# EAGLE design matrix-only (EAGLE 6.5.0)
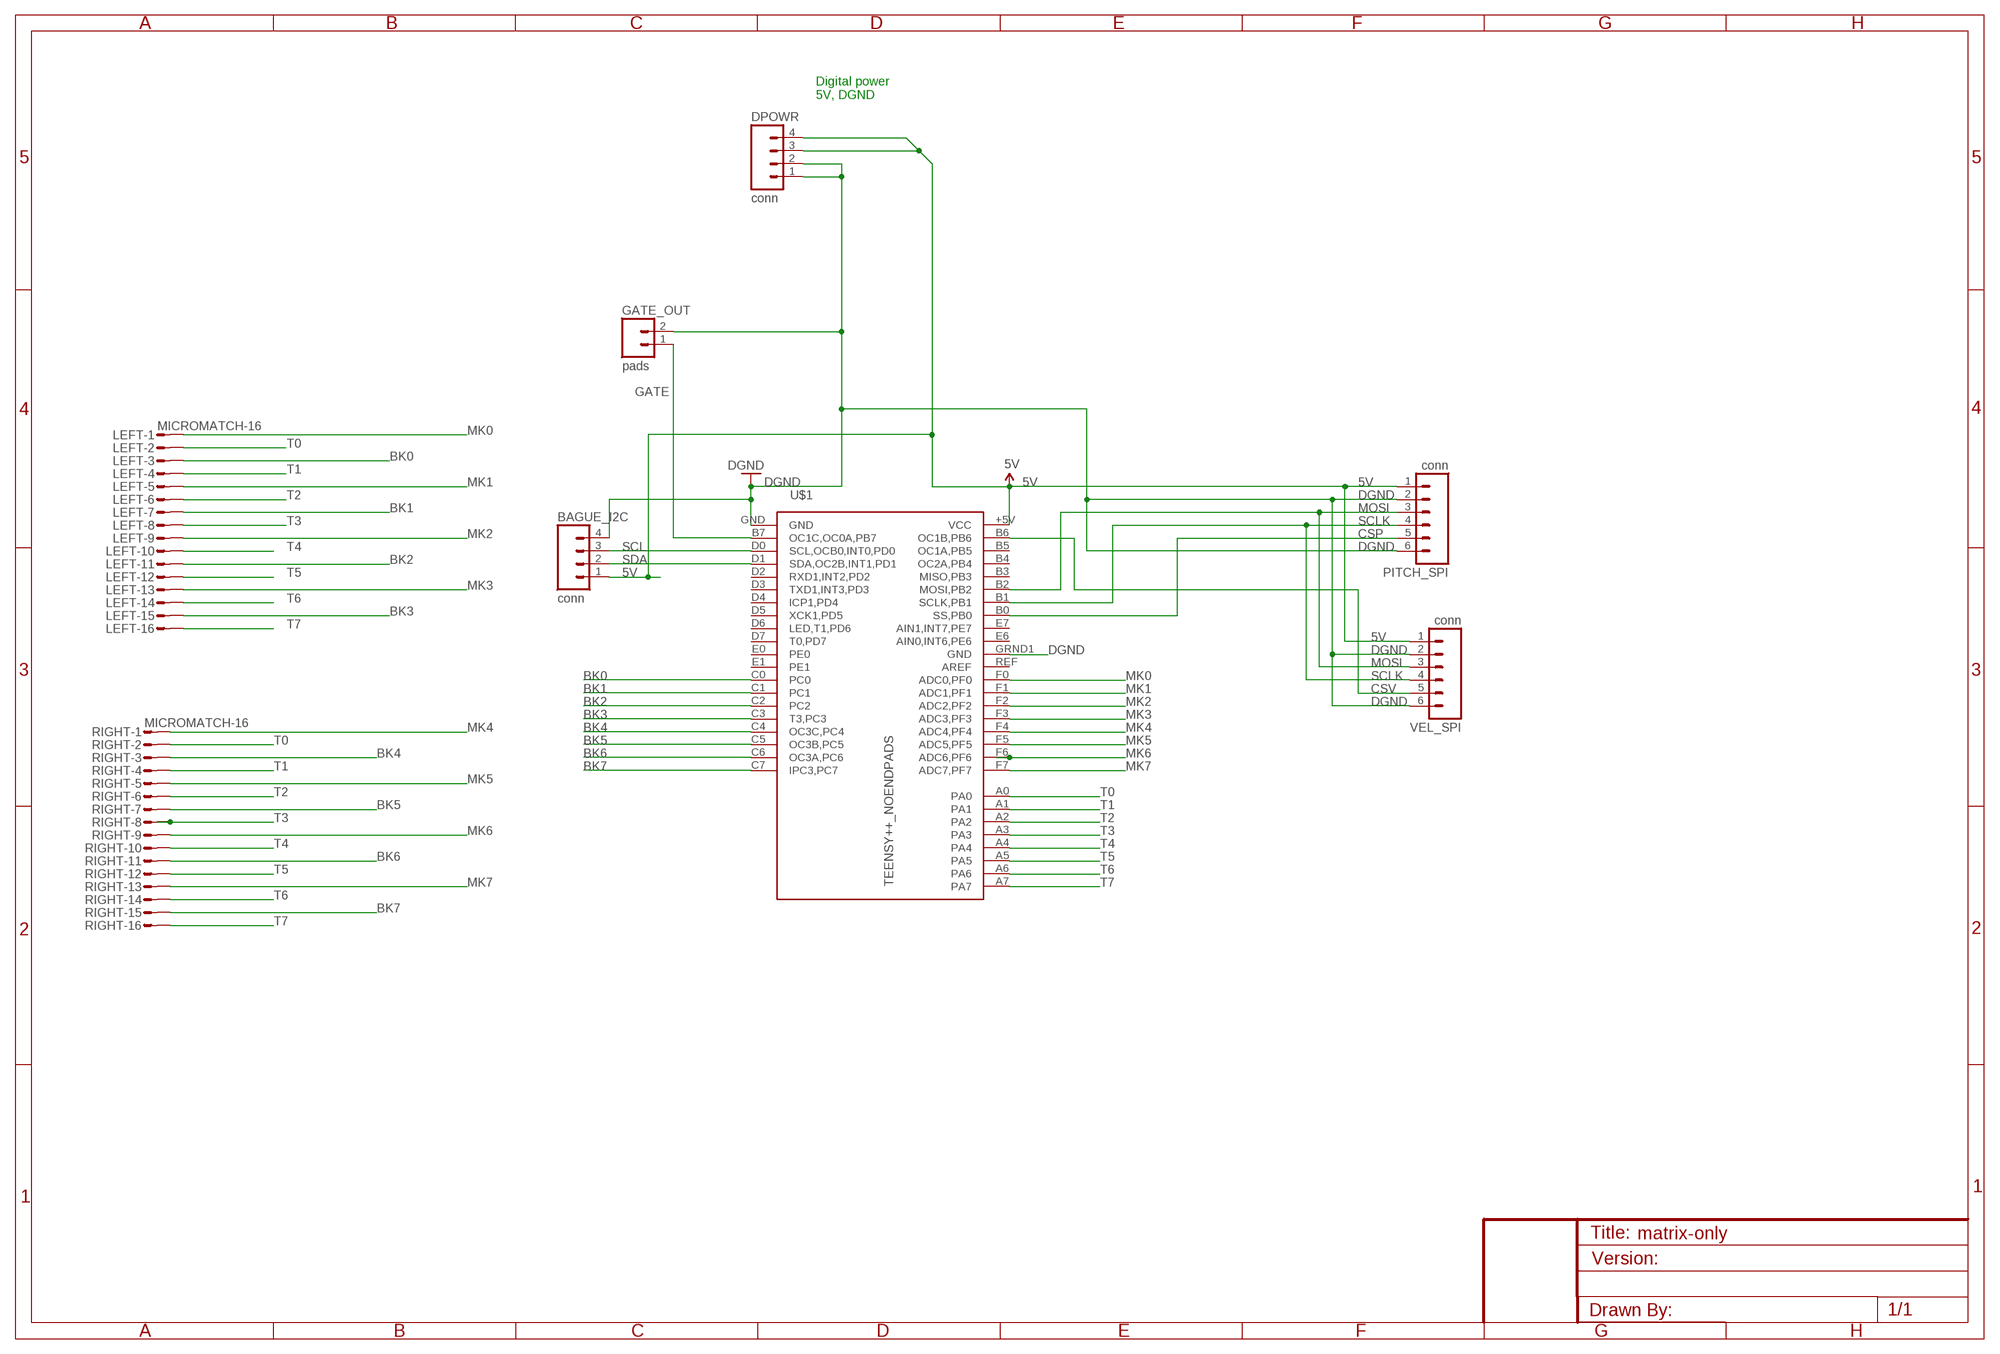
[diagram p0: schematic, sheet 1]

## Parts
BAGUE_I2C  conn  M04LOCK  [1X04_LOCK]
DPOWR  conn  M04PTH  [1X04]
GATE_OUT  pads  M02PTH3  [1X02_LONGPADS]
LEFT  MICROMATCH-16  [MICROMATCH-16]
PITCH_SPI  conn  M06SIP  [1X06]
RIGHT  MICROMATCH-16  [MICROMATCH-16]
U$1  TEENSY++_NOENDPADS  [TEENSY++]
VEL_SPI  conn  M06SIP  [1X06]

## Nets
5V: BAGUE_I2C.1 DPOWR.3 DPOWR.4 PITCH_SPI.1 U$1.+5V(VCC) VEL_SPI.1
BK0: LEFT.3 U$1.C0
BK1: LEFT.7 U$1.C1
BK2: LEFT.11 U$1.C2
BK3: LEFT.15 U$1.C3(T3,PC3)
BK4: RIGHT.3 U$1.C4(OC3C,PC4)
BK5: RIGHT.7 U$1.C5(OC3B,PC5)
BK6: RIGHT.11 U$1.C6(OC3A,PC6)
BK7: RIGHT.15 U$1.C7(IPC3,PC7)
CSP: PITCH_SPI.5 U$1.B0(SS,PB0)
CSV: U$1.B6(OC1B,PB6) VEL_SPI.5
DGND: BAGUE_I2C.4 DPOWR.1 DPOWR.2 GATE_OUT.2 PITCH_SPI.2 PITCH_SPI.6 U$1.GND U$1.GRND1(GND) VEL_SPI.2 VEL_SPI.6
GATE: GATE_OUT.1 U$1.B7(OC1C,OC0A,PB7)
MK0: LEFT.1 U$1.F0(ADC0,PF0)
MK1: LEFT.5 U$1.F1(ADC1,PF1)
MK2: LEFT.9 U$1.F2(ADC2,PF2)
MK3: LEFT.13 U$1.F3(ADC3,PF3)
MK4: RIGHT.1 U$1.F4(ADC4,PF4)
MK5: RIGHT.5 U$1.F5(ADC5,PF5)
MK6: RIGHT.9 U$1.F6(ADC6,PF6)
MK7: RIGHT.13 U$1.F7(ADC7,PF7)
MOSI: PITCH_SPI.3 U$1.B2(MOSI,PB2) VEL_SPI.3
SCL: BAGUE_I2C.3 U$1.D0(SCL,OCB0,INT0,PD0)
SCLK: PITCH_SPI.4 U$1.B1(SCLK,PB1) VEL_SPI.4
SDA: BAGUE_I2C.2 U$1.D1(SDA,OC2B,INT1,PD1)
T0: LEFT.2 RIGHT.2 U$1.A0
T1: LEFT.4 RIGHT.4 U$1.A1
T2: LEFT.6 RIGHT.6 U$1.A2
T3: LEFT.8 RIGHT.8 U$1.A3
T4: LEFT.10 RIGHT.10 U$1.A4
T5: LEFT.12 RIGHT.12 U$1.A5
T6: LEFT.14 RIGHT.14 U$1.A6
T7: LEFT.16 RIGHT.16 U$1.A7
Unconnected: U$1.B3(MISO,PB3) U$1.B4(OC2A,PB4) U$1.B5(OC1A,PB5) U$1.D2(RXD1,INT2,PD2) U$1.D3(TXD1,INT3,PD3) U$1.D4(ICP1,PD4) U$1.D5(XCK1,PD5) U$1.D6(LED,T1,PD6) U$1.D7(T0,PD7) U$1.E0 U$1.E1 U$1.E6(AIN0,INT6,PE6) U$1.E7(AIN1,INT7,PE7) U$1.REF(AREF)

## Notes on the sheet
- Digital power
  5V, DGND

## Library data of the parts
BAGUE_I2C DPOWR = SparkFun-Connectors:M04: Header 4 Standard 4-pin 0.1" header. Use with straight break away headers (SKU : PRT-00116), right angle break away headers (PRT-00553), swiss pins (PRT-00743), machine pins (PRT-00117), and female headers (PRT-00115). Molex polarized connector foot print use with SKU : PRT-08231 with associated crimp pins and housings. 1MM SMD Version SKU: PRT-10208
GATE_OUT = SparkFun-Connectors:M02: Standard 2-pin 0.1" header. Use with - straight break away headers ( PRT-00116) - right angle break away headers (PRT-00553) - swiss pins (PRT-00743) - machine pins (PRT-00117) - female headers (PRT-00115) Molex polarized connector foot print use with: PRT-08233 with associated crimp pins and housings. 2.54_SCREWTERM for use with PRT-10571. 3.5mm Screw Terminal footprints for PRT-08084 5mm Screw Terminal footprints for use with PRT-08433
LEFT RIGHT = con-amp-micromatch:MICROMATCH-16: MicroMaTch 16 8-215464-6 / 1-215464-6 Drawing Number C-215464 DDEController.pdf; MF: FARNELL; MPN: 8-215464-6; OC_FARNELL: 3784680; OC_NEWARK: 26H3309
PITCH_SPI VEL_SPI = SparkFun-Connectors:M06: Header 6 Standard 6-pin 0.1" header. Use with straight break away headers (SKU : PRT-00116), right angle break away headers (PRT-00553), swiss pins (PRT-00743), machine pins (PRT-00117), and female headers (PRT-00115). Molex polarized connector foot print use with SKU : PRT-08094 with associated crimp pins and housings. NOTES ON THE VARIANTS LOCK and LOCK_LONGPADS... This footprint was designed to help hold the alignment of a through-hole component (i.e. 6-pin header) while soldering it into place. You may notice that each hole has been shifted either up or down by 0.005 of an inch from it's more standard position (which is a perfectly straight line). This slight alteration caused the pins (the squares in the middle) to touch the edges of the holes. Because they are alternating, it causes a "brace" to hold the component in place. 0.005 has proven to be the perfect amount of "off-center" position when using our standard breakaway headers. Although looks a little odd when you look at the bare footprint, once you have a header in there, the alteration is very hard to notice. Also,if you push a header all the way into place, it is covered up entirely on the bottom side. This idea of altering the position of holes to aid alignment will be further integrated into the Sparkfun Library for other footprints. It can help hold any component with 3 or more connection pins.
U$1 = Teensy:TEENSY++_NOENDPADS

## Board
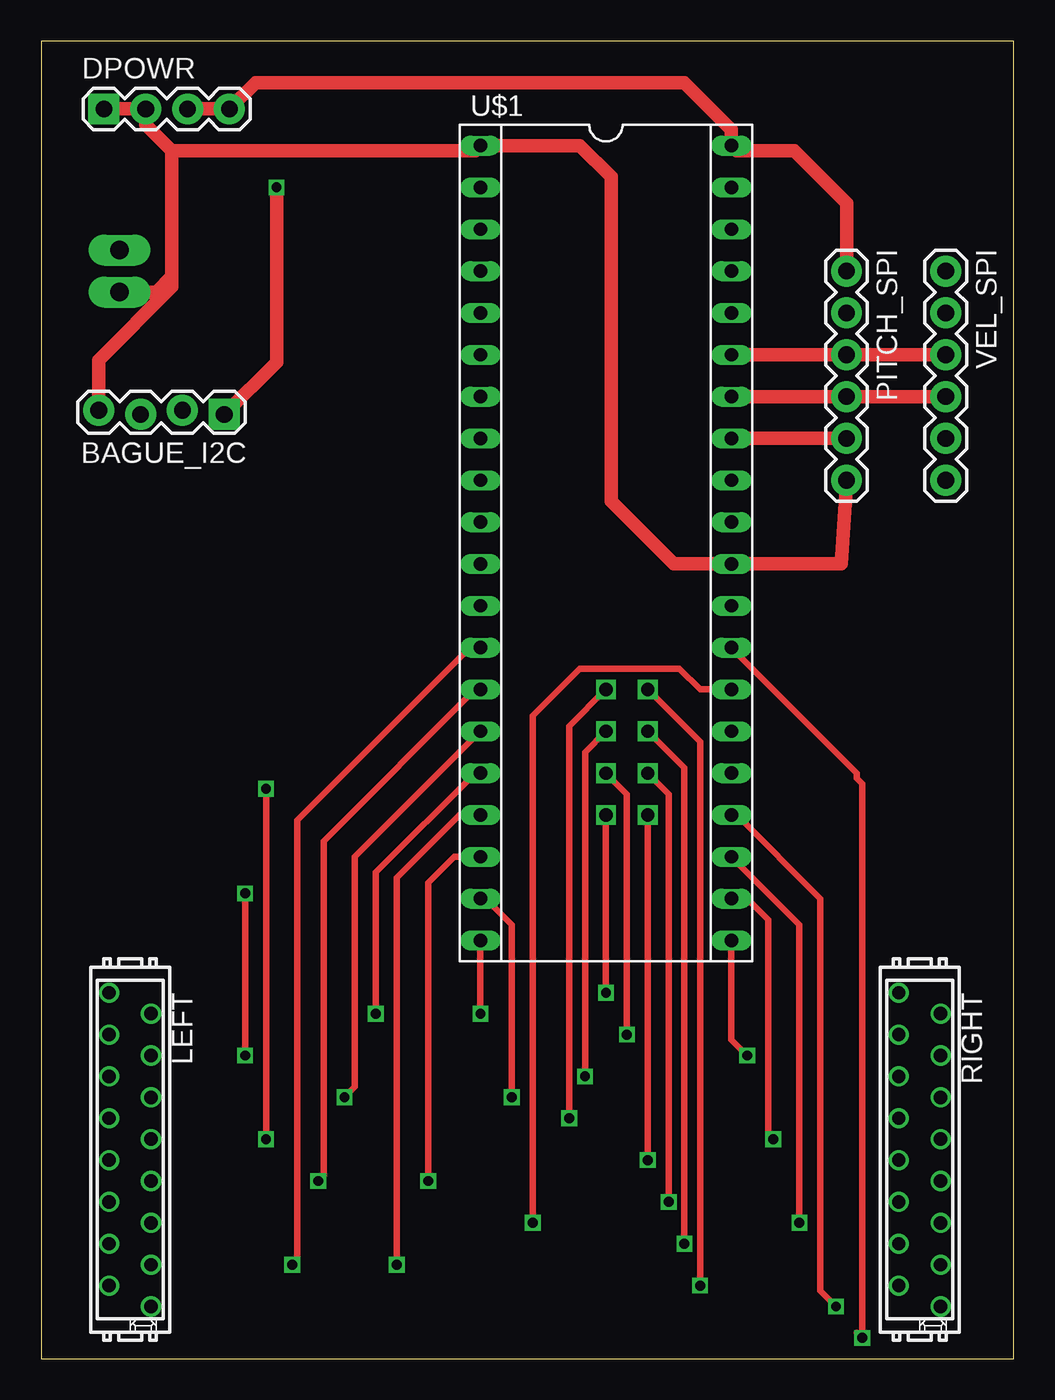
[diagram p1: board, top side]
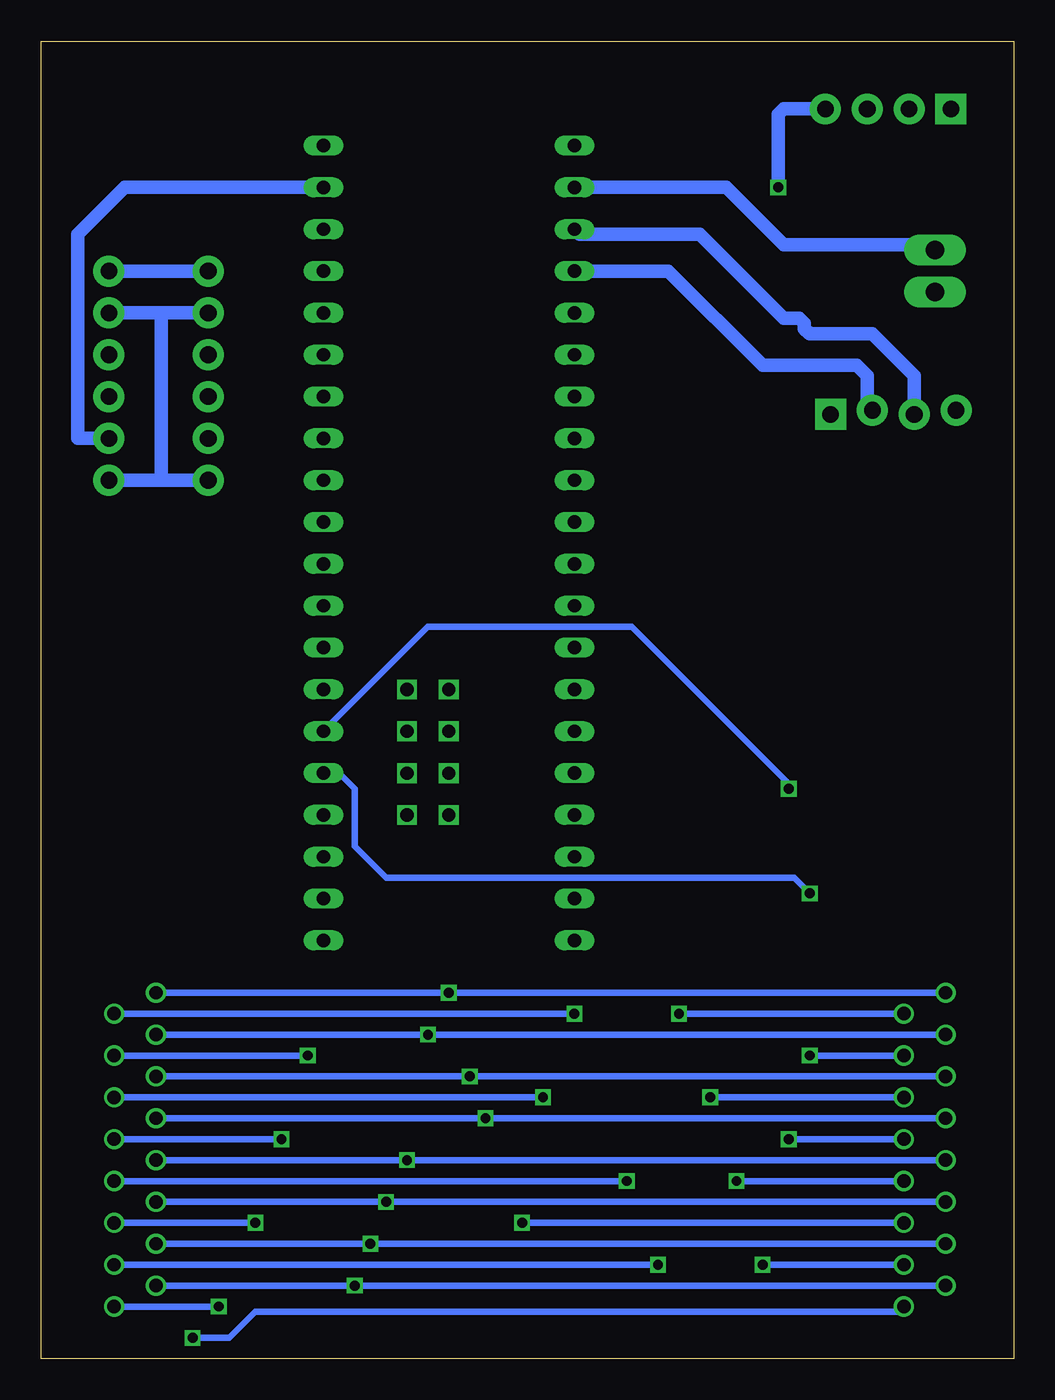
[diagram p2: board, bottom side, seen from below]

Size 59.04 x 80 mm. Coordinates in mm from the lower left corner, seen from the top.
Outline: 0,0 59.04,0 59.04,80 0,80 0,0
Copper layers (1*16): Top 0.0356mm / dielectric 1.5011mm / Bottom 0.0356mm
Design rules "LaenPCBOrder": minimum track width 6mil, minimum drill 13mil, track to track 6mil, track to pad 6mil, pad to pad 6mil, via to via 6mil, smd to smd 6mil, copper to edge 15mil, drill to drill 6mil, minimum pad ring 7mil, minimum via ring 7mil, stop-mask expansion 3mil, vias tented up to drill 0mil, thermal gap 10mil

### Footprints (pad centres in the part's own frame; a part is rotated, then mirrored left to right if it is on the bottom)
1X04_LOCK = drill 1.016 pad 1.88 square: 1 0,0.127 | drill 1.016 pad 1.88: 2 2.54,-0.127; 3 5.08,0.127; 4 7.62,-0.127
1X04 = drill 1.016 pad 1.88 square: 1 0,0 | drill 1.016 pad 1.88: 2 2.54,0; 3 5.08,0; 4 7.62,0
1X02_LONGPADS = drill 1.118 pad 1.88 long: 1 0,0; 2 2.54,0
MICROMATCH-16 = drill 0.813: 1 9.525,1.27; 2 8.255,-1.27; 3 6.985,1.27; 4 5.715,-1.27; 5 4.445,1.27; 6 3.175,-1.27; 7 1.905,1.27; 8 0.635,-1.27; 9 -0.635,1.27; 10 -1.905,-1.27; 11 -3.175,1.27; 12 -4.445,-1.27; 13 -5.715,1.27; 14 -6.985,-1.27; 15 -8.255,1.27; 16 -9.525,-1.27
1X06 = drill 1.016 pad 1.88: 1 0,0; 2 2.54,0; 3 5.08,0; 4 7.62,0; 5 10.16,0; 6 12.7,0
TEENSY++ = drill 0.813 long: +5V -24.13,7.62; B0 -6.35,7.62; B1 -8.89,7.62; B2 -11.43,7.62; B3 -13.97,7.62; B4 -16.51,7.62; B5 -19.05,7.62; B6 -21.59,7.62; B7 -21.59,-7.62; C0 6.35,-7.62; C1 8.89,-7.62; C2 11.43,-7.62; C3 13.97,-7.62; C4 16.51,-7.62; C5 19.05,-7.62; C6 21.59,-7.62; C7 24.13,-7.62; D0 -19.05,-7.62; D1 -16.51,-7.62; D2 -13.97,-7.62; D3 -11.43,-7.62; D4 -8.89,-7.62; D5 -6.35,-7.62; D6 -3.81,-7.62; D7 -1.27,-7.62; E0 1.27,-7.62; E1 3.81,-7.62; E6 -1.27,7.62; E7 -3.81,7.62; F0 6.35,7.62; F1 8.89,7.62; F2 11.43,7.62; F3 13.97,7.62; F4 16.51,7.62; F5 19.05,7.62; F6 21.59,7.62; F7 24.13,7.62; GND -24.13,-7.62; GRND1 1.27,7.62; REF 3.81,7.62 | drill 0.8 square: A0 8.89,2.54; A1 11.43,2.54; A2 13.97,2.54; A3 16.51,2.54; A4 8.89,0; A5 11.43,0; A6 13.97,0; A7 16.51,0

### Placement (x,y rotation side)
BAGUE_I2C  11.11,57.47 180 top
DPOWR  3.81,75.88 0 top
GATE_OUT  4.76,67.31 270 top
LEFT  5.4,12.7 270 top
PITCH_SPI  48.9,66.04 270 top
RIGHT  53.34,12.7 270 top
U$1  34.29,49.53 270 top
VEL_SPI  54.93,66.04 270 top

### Tracks (layer width: path | path; a pad name or v marks a point on that pad's centre or on a via)
5V  (via drill 0.6)
  Top 0.813: DPOWR.3 DPOWR.4 13.02,77.47 39.05,77.47 41.91,74.61 U$1.+5V 42.23,73.34 45.72,73.34 48.9,70.17 PITCH_SPI.1 | BAGUE_I2C.1 14.29,60.52 v14.29,71.12
  Bottom 0.813: VEL_SPI.1 PITCH_SPI.1 | v14.29,71.12 14.29,75.56 13.97,75.88 DPOWR.4
BK0  (via drill 0.6)
  Top 0.406: v15.24,5.71 15.56,6.03 15.56,32.7 26.04,43.18 U$1.C0
  Bottom 0.406: LEFT.3 v15.24,5.71
BK1  (via drill 0.6)
  Top 0.406: v16.83,10.79 17.14,11.11 17.14,31.43 26.35,40.64 U$1.C1
  Bottom 0.406: LEFT.7 v16.83,10.79
BK2  (via drill 0.6)
  Top 0.406: v18.41,15.88 19.05,16.51 19.05,30.48 U$1.C2
  Bottom 0.406: LEFT.11 v18.41,15.88
BK3  (via drill 0.6)
  Top 0.406: v20.32,20.95 20.32,29.53 26.35,35.56 U$1.C3
  Bottom 0.406: LEFT.15 v20.32,20.95
BK4  (via drill 0.6)
  Top 0.406: v21.59,5.71 21.59,29.21 25.4,33.02 U$1.C4
  Bottom 0.406: RIGHT.3 v21.59,5.71
BK5  (via drill 0.6)
  Top 0.406: v23.5,10.79 23.5,28.89 25.08,30.48 U$1.C5
  Bottom 0.406: RIGHT.7 v23.5,10.79
BK6  (via drill 0.6)
  Top 0.406: v28.57,15.88 28.57,26.35 26.99,27.94 U$1.C6
  Bottom 0.406: RIGHT.11 v28.57,15.88
BK7  (via drill 0.6)
  Top 0.406: v26.67,20.95 U$1.C7
  Bottom 0.406: RIGHT.15 v26.67,20.95
CSP
  Top 0.813: PITCH_SPI.5 U$1.B0
CSV
  Bottom 0.813: VEL_SPI.5 56.83,55.88 56.83,68.26 53.98,71.12 U$1.B6
DGND
  Top 0.813: DPOWR.1 DPOWR.2 6.35,74.93 7.94,73.34 | PITCH_SPI.6 48.58,48.26 U$1.GRND1 38.42,48.26 34.61,52.07 34.61,71.75 32.7,73.66 U$1.GND 26.35,73.34 7.94,73.34 | GATE_OUT.2 6.99,64.77 7.94,65.72 | 7.94,65.72 7.94,73.34 | BAGUE_I2C.4 3.49,60.64 7.94,65.09 7.94,65.72
  Bottom 0.813: VEL_SPI.6 51.75,53.34 | 51.75,53.34 PITCH_SPI.6 | VEL_SPI.2 51.75,63.5 | 51.75,63.5 PITCH_SPI.2 | 51.75,63.5 51.75,53.34
GATE
  Bottom 0.813: U$1.B7 17.46,71.12 13.97,67.63 5.08,67.63 GATE_OUT.1
MK0  (via drill 0.6)
  Top 0.406: 49.53,1.59 v49.85,1.27 49.85,34.92 49.53,35.24 49.53,35.56 U$1.F0
  Bottom 0.406: LEFT.1 6.99,2.86 46.04,2.86 47.62,1.27 v49.85,1.27
MK1  (via drill 0.6)
  Top 0.406: v29.84,8.26 29.84,39.05 32.7,41.91 38.73,41.91 40.01,40.64 U$1.F1
  Bottom 0.406: LEFT.5 v29.84,8.26
MK2  (via drill 0.6)
  Top 0.406: v13.65,34.61 v13.65,13.34
  Bottom 0.406: U$1.F2 35.56,44.45 23.18,44.45 13.65,34.92 v13.65,34.61 | v13.65,13.34 LEFT.9
MK3  (via drill 0.6)
  Top 0.406: v12.38,18.41 v12.38,28.26
  Bottom 0.406: LEFT.13 v12.38,18.41 | v12.38,28.26 13.34,29.21 38.1,29.21 40.01,31.11 40.01,34.61 40.96,35.56 U$1.F3
MK4  (via drill 0.6)
  Top 0.406: v48.26,3.17 47.31,4.13 47.31,27.94 42.23,33.02 U$1.F4
  Bottom 0.406: RIGHT.1 v48.26,3.17
MK5  (via drill 0.6)
  Top 0.406: U$1.F5 46.04,26.35 v46.04,8.26
  Bottom 0.406: v46.04,8.26 RIGHT.5
MK6  (via drill 0.6)
  Top 0.406: v44.45,13.34 44.13,13.65 44.13,26.67 42.86,27.94 U$1.F6
  Bottom 0.406: RIGHT.9 v44.45,13.34
MK7  (via drill 0.6)
  Top 0.406: U$1.F7 41.91,19.37 v42.86,18.41
  Bottom 0.406: v42.86,18.41 RIGHT.13
MOSI
  Top 0.813: U$1.B2 PITCH_SPI.3 VEL_SPI.3
SCL
  Bottom 0.813: U$1.D0 26.35,68.26 19.05,68.26 13.97,63.18 13.02,63.18 12.7,62.87 12.7,62.55 12.38,62.23 8.57,62.23 6.03,59.69 BAGUE_I2C.3
SCLK
  Top 0.813: U$1.B1 PITCH_SPI.4 VEL_SPI.4
SDA
  Bottom 0.813: BAGUE_I2C.2 8.89,57.91 8.89,59.69 9.53,60.33 15.24,60.33 20.95,66.04 U$1.D1
T0  (via drill 0.6)
  Top 0.406: U$1.A0 40.01,37.47 v40.01,4.45
  Bottom 0.406: RIGHT.2 v40.01,4.45 LEFT.2
T1  (via drill 0.6)
  Top 0.406: U$1.A1 39.05,35.88 v39.05,6.99
  Bottom 0.406: RIGHT.4 v39.05,6.99 LEFT.4
T2  (via drill 0.6)
  Top 0.406: U$1.A2 38.1,34.29 v38.1,9.53
  Bottom 0.406: RIGHT.6 v38.1,9.53 LEFT.6
T3  (via drill 0.6)
  Top 0.406: U$1.A3 v36.83,12.06
  Bottom 0.406: RIGHT.8 v36.83,12.06 LEFT.8
T4  (via drill 0.6)
  Top 0.406: U$1.A4 32.07,38.42 v32.07,14.61
  Bottom 0.406: RIGHT.10 v32.07,14.61 LEFT.10
T5  (via drill 0.6)
  Top 0.406: U$1.A5 33.02,36.83 v33.02,17.14
  Bottom 0.406: RIGHT.12 v33.02,17.14 LEFT.12
T6  (via drill 0.6)
  Top 0.406: U$1.A6 35.56,34.29 v35.56,19.68
  Bottom 0.406: RIGHT.14 v35.56,19.68 LEFT.14
T7  (via drill 0.6)
  Top 0.406: U$1.A7 v34.29,22.23
  Bottom 0.406: RIGHT.16 v34.29,22.23 LEFT.16
(copper drawn outside any net)
  shapes: Top area x1